# EAGLE design JustinWheelPCB1.2 (EAGLE 9.6.2)
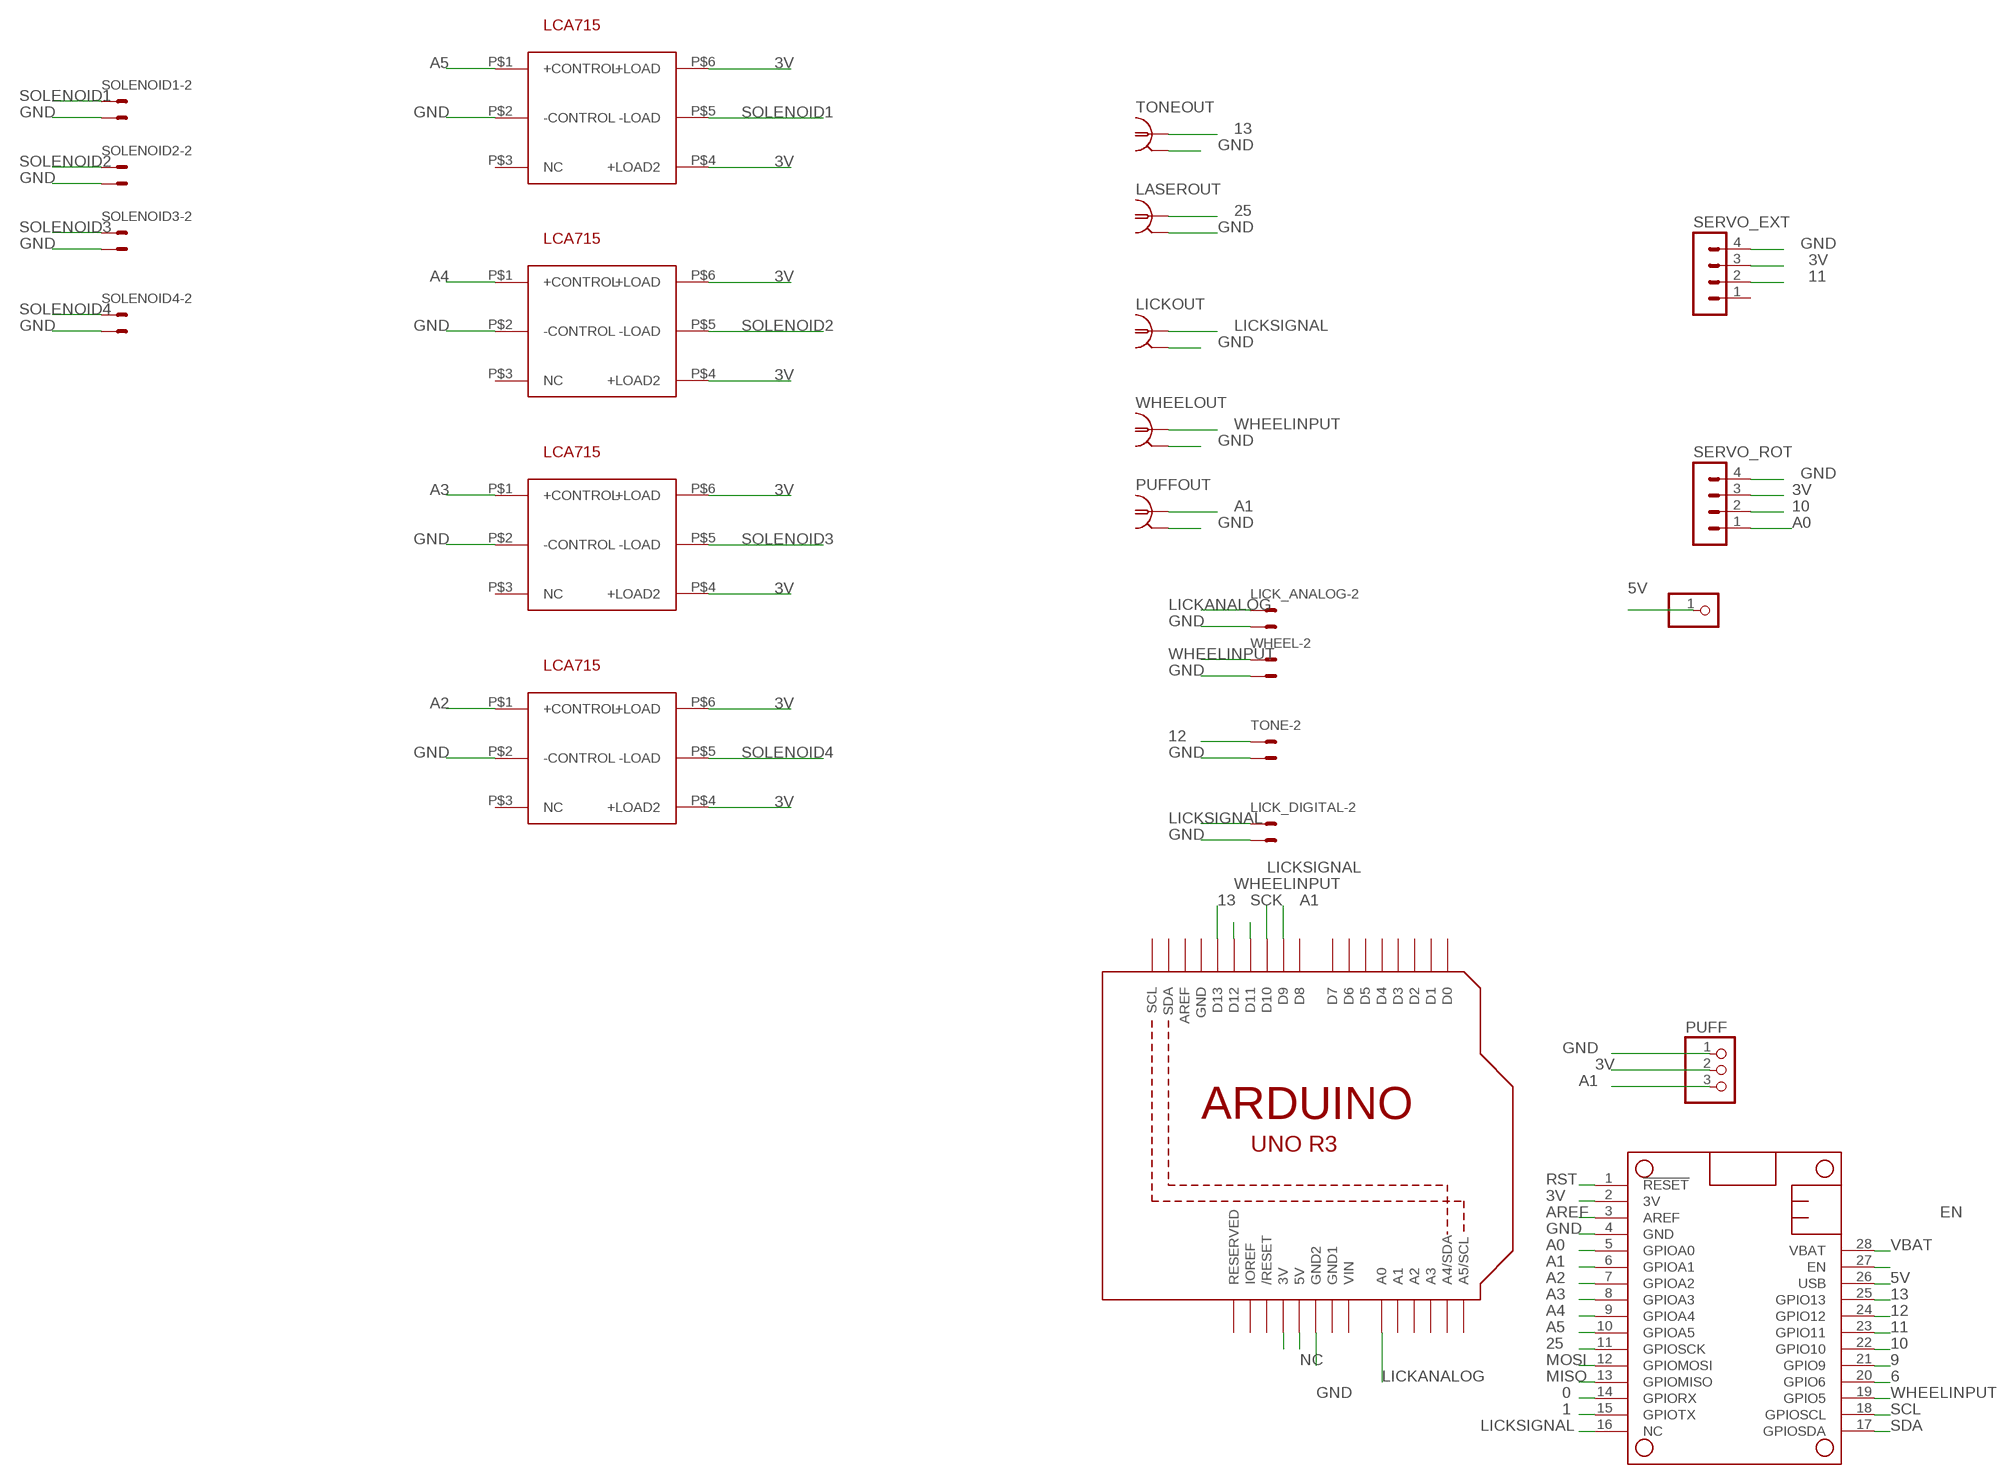
[diagram p0: schematic, sheet 1]

## Parts
JP1  PINHD-1X1  [1X01]
LASEROUT  1-227161-0  [AMP_227161]
LICK_ANALOG  22-23-2021  [22-23-2021]
LICK_DIGITAL  22-23-2021  [22-23-2021]
LICKOUT  1-227161-0  [AMP_227161]
MS2  MICROSHIELD_NODIM  [MICROSHIELD_DIM]
PUFF  PINHD-1X3  [1X03]
PUFFOUT  1-227161-0  [AMP_227161]
SERVO_EXT  MA04-1  [MA04-1]
SERVO_ROT  MA04-1  [MA04-1]
SOL1  LCA715S  [LCA7XX]
SOL2  LCA715S  [LCA7XX]
SOL3  LCA715S  [LCA7XX]
SOL4  LCA715S  [LCA7XX]
SOLENOID1  22-23-2021  [22-23-2021]
SOLENOID2  22-23-2021  [22-23-2021]
SOLENOID3  22-23-2021  [22-23-2021]
SOLENOID4  22-23-2021  [22-23-2021]
TONE  22-23-2021  [22-23-2021]
TONEOUT  1-227161-0  [AMP_227161]
U1  ARDUINOR3-BPLACE  [ARDUINOR3-BPLACE]
WHEEL  22-23-2021  [22-23-2021]
WHEELOUT  1-227161-0  [AMP_227161]

## Nets
0: MS2.14(GPIORX)
1: MS2.15(GPIOTX)
3V: MS2.2(3V) PUFF.2 SERVO_EXT.3 SERVO_ROT.3 SOL1.P$4(+LOAD2) SOL1.P$6(+LOAD) SOL2.P$4(+LOAD2) SOL2.P$6(+LOAD) SOL3.P$4(+LOAD2) SOL3.P$6(+LOAD) SOL4.P$4(+LOAD2) SOL4.P$6(+LOAD)
5V: JP1.1 MS2.26(USB)
6: MS2.20(GPIO6)
9: MS2.21(GPIO9)
10: MS2.22(GPIO10) SERVO_ROT.2
11: MS2.23(GPIO11) SERVO_EXT.2
12: MS2.24(GPIO12) TONE.1
13: MS2.25(GPIO13) TONEOUT.1 U1.D13
25: LASEROUT.1 MS2.11(GPIOSCK)
A0: MS2.5(GPIOA0) SERVO_ROT.1
A1: MS2.6(GPIOA1) PUFF.3 PUFFOUT.1 U1.D9
A2: MS2.7(GPIOA2) SOL4.P$1(+CONTROL)
A3: MS2.8(GPIOA3) SOL3.P$1(+CONTROL)
A4: MS2.9(GPIOA4) SOL2.P$1(+CONTROL)
A5: MS2.10(GPIOA5) SOL1.P$1(+CONTROL)
AREF: MS2.3(AREF)
EN: MS2.27(EN)
GND [gnd]: LASEROUT.2 LICK_ANALOG.2 LICK_DIGITAL.2 LICKOUT.2 MS2.4(GND) PUFF.1 PUFFOUT.2 SERVO_EXT.4 SERVO_ROT.4 SOL1.P$2(-CONTROL) SOL2.P$2(-CONTROL) SOL3.P$2(-CONTROL) SOL4.P$2(-CONTROL) SOLENOID1.2 SOLENOID2.2 SOLENOID3.2 SOLENOID4.2 TONE.2 TONEOUT.2 U1.GND2 WHEEL.2 WHEELOUT.2
LICKANALOG: LICK_ANALOG.1 U1.A0
LICKSIGNAL: LICK_DIGITAL.1 LICKOUT.1 MS2.16(NC) U1.D10
MISO: MS2.13(GPIOMISO)
MOSI: MS2.12(GPIOMOSI)
N$1: U1.3V
NC: U1.5V
RST: MS2.1(!RESET)
SCK: U1.D11
SCL: MS2.18(GPIOSCL)
SDA: MS2.17(GPIOSDA)
SOLENOID1: SOL1.P$5(-LOAD) SOLENOID1.1
SOLENOID2: SOL2.P$5(-LOAD) SOLENOID2.1
SOLENOID3: SOL3.P$5(-LOAD) SOLENOID3.1
SOLENOID4: SOL4.P$5(-LOAD) SOLENOID4.1
VBAT: MS2.28(VBAT)
WHEELINPUT: MS2.19(GPIO5) U1.D12 WHEEL.1 WHEELOUT.1
Unconnected: SERVO_EXT.1 SOL1.P$3(NC) SOL2.P$3(NC) SOL3.P$3(NC) SOL4.P$3(NC) U1.A1 U1.A2 U1.A3 U1.A4(A4/SDA) U1.A5(A5/SCL) U1.AREF U1.D0 U1.D1 U1.D2 U1.D3 U1.D4 U1.D5 U1.D6 U1.D7 U1.D8 U1.IOREF U1.RESERVED U1.RESET(/RESET) U1.SCL U1.SDA

## Power pins joined to a net without a drawn wire
GND: U1.GND
GND1: U1.GND1
VIN: U1.VIN

## Library data of the parts
JP1 = pinhead:PINHD-1X1: PIN HEADER
LASEROUT LICKOUT PUFFOUT TONEOUT WHEELOUT = con-coax:?227161*: JACK, RIGHT ANGLE, 50 OHM, PCB, BNC Source: amp_227161.pdf; MF: TYCO ELECTRONICS; MPN: 1-227161; OC_FARNELL: unknown; OC_NEWARK: 33B3200
LICK_ANALOG LICK_DIGITAL SOLENOID1-SOLENOID4 TONE WHEEL = con-molex:22-23-2021: .100" (2.54mm) Center Header - 2 Pin; MF: MOLEX; MPN: 22-23-2021; OC_FARNELL: 1462926; OC_NEWARK: 25C3832
MS2 = M4:MICROSHIELD
PUFF = adafruit:PINHD-1X3: PIN HEADER
SERVO_EXT SERVO_ROT = con-lstb:MA04-1: PIN HEADER; OC_FARNELL: unknown; OC_NEWARK: unknown
SOL1-SOL4 = Mohamed's-library:LCA715S
U1 = adafruit:ARDUINOR3: This is a new object for the new Arduino R3 - with extra pins that you may want to use (such as IOref, and duplicated A4/A5

## Net classes
1 power: width 0.305 mm
2 gnd: width 0.254 mm

## Board
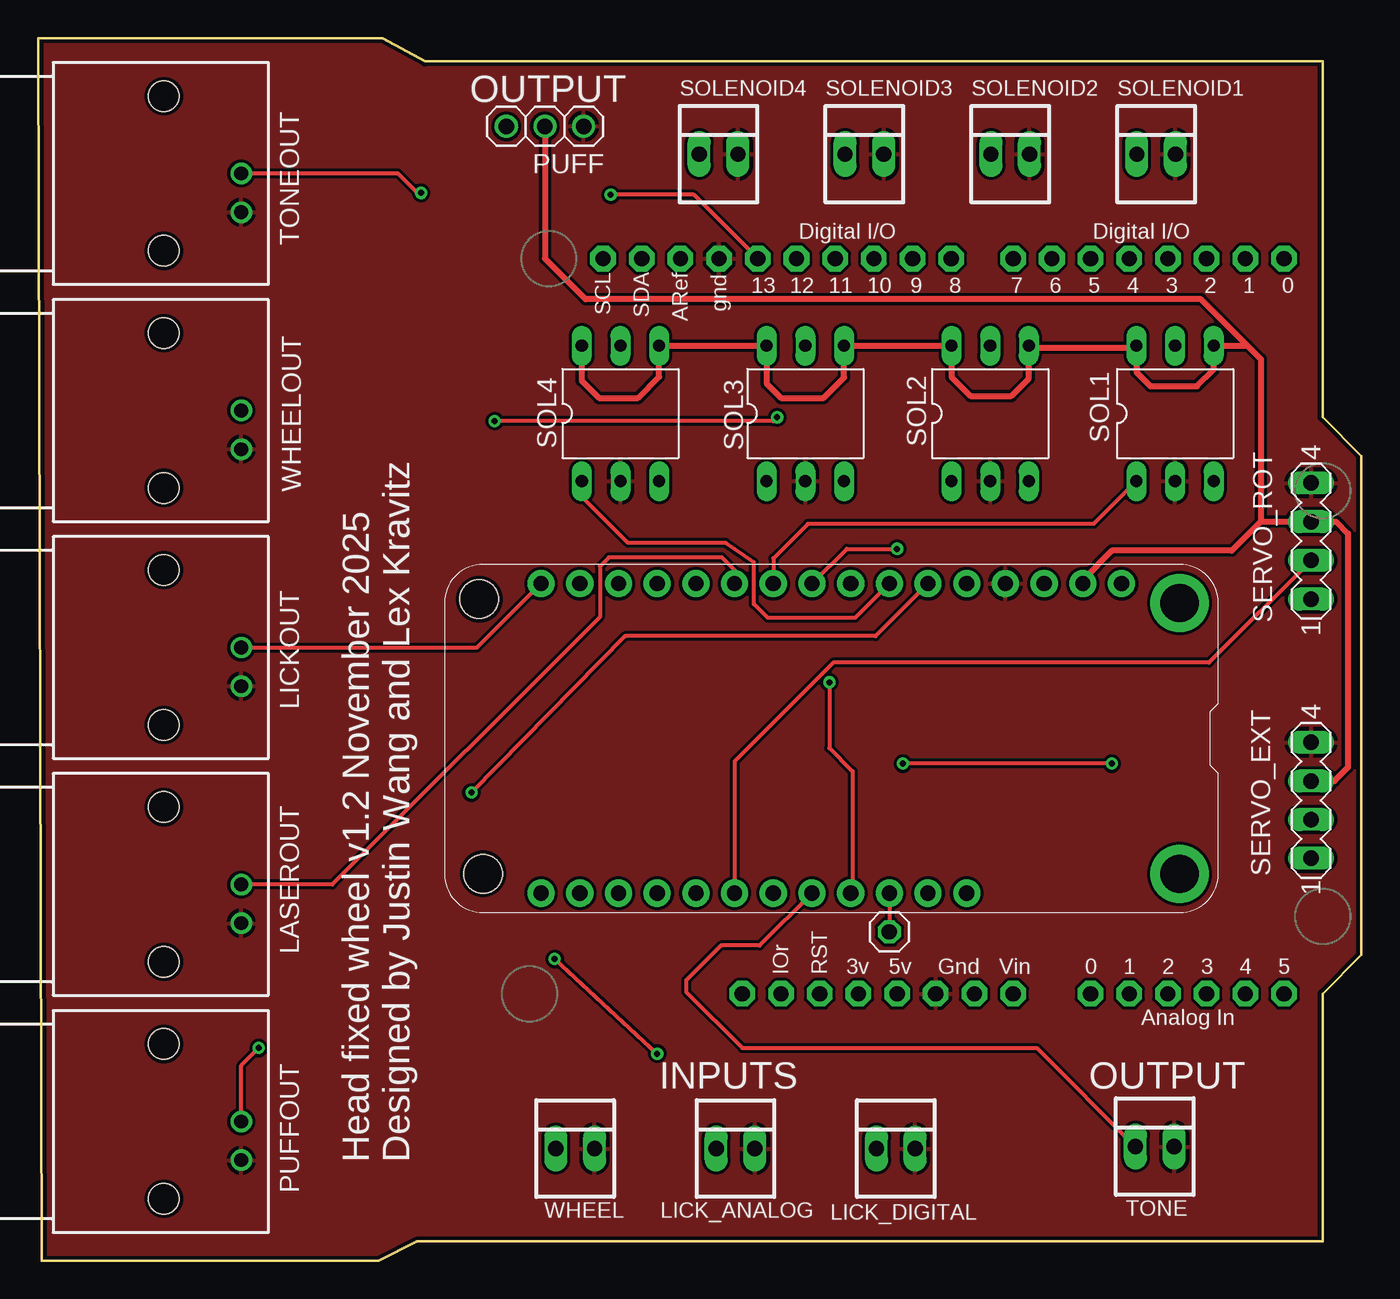
[diagram p1: board, top side]
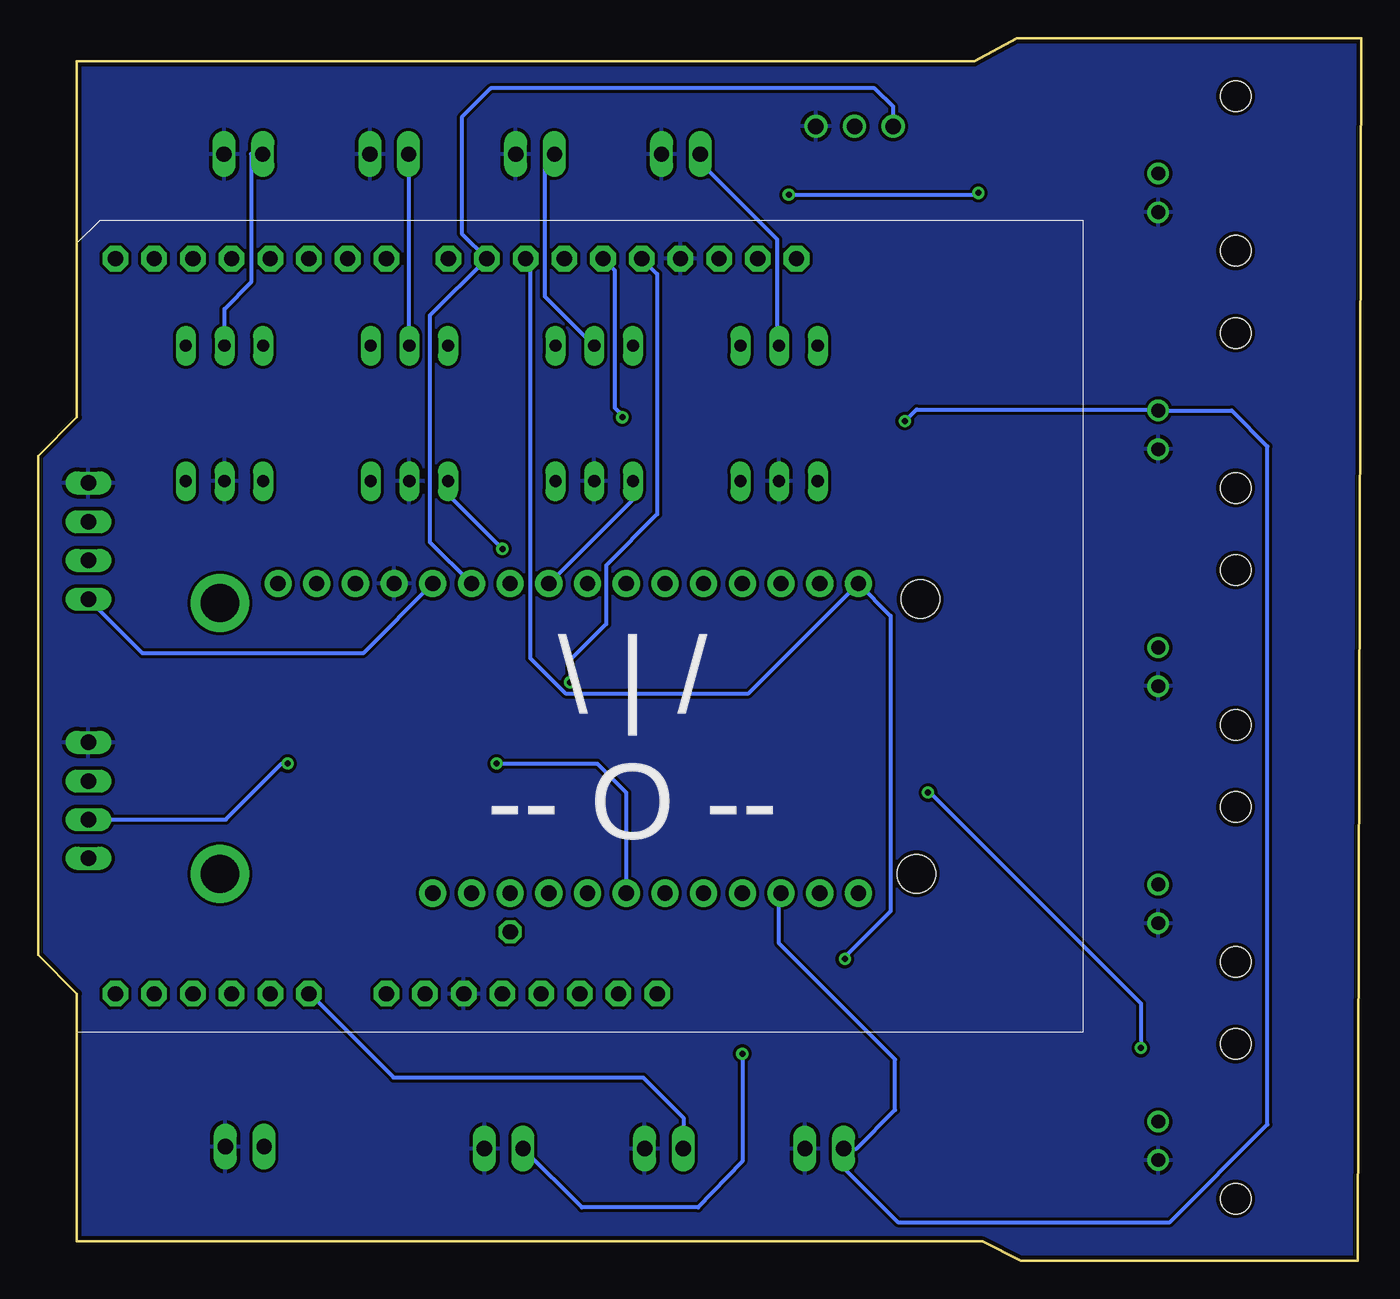
[diagram p2: board, bottom side, seen from below]

Size 86.87 x 80.26 mm. Coordinates in mm from the lower left corner, seen from the top.
Outline: 84.33,55.37 84.33,78.74 25.4,78.74 22.61,80.26 0,80.26 0.25,0 22.35,0 24.89,1.27 84.33,1.27 84.33,17.53 86.87,20.07 86.87,52.83 84.33,55.37
Copper layers (1*16): Top 0.035mm / dielectric 1.5mm / Bottom 0.035mm
Design rules "adafruit": minimum track width 8mil, minimum drill 15.5mil, track to track 8mil, track to pad 8mil, pad to pad 8mil, via to via 8mil, smd to smd 8mil, copper to edge 10mil, drill to drill 8mil, minimum pad ring 10mil, minimum via ring 8mil, stop-mask expansion 2mil, vias tented up to drill 20mil, thermal gap 10mil

### Footprints (pad centres in the part's own frame; a part is rotated, then mirrored left to right if it is on the bottom)
1X01 = drill 1.016 octagon: 1 0,0
AMP_227161 = drill 0.9 pad 1.27: 1 0,-5.08; 2 -2.54,-5.08 | hole 2: -5.08,0; 5.08,0
22-23-2021 = drill 1 long: 1 -1.27,0; 2 1.27,0
MICROSHIELD_DIM = drill 1 pad 1.778: 1 6.35,1.27; 2 8.89,1.27; 3 11.43,1.27; 4 13.97,1.27; 5 16.51,1.27; 6 19.05,1.27; 7 21.59,1.27; 8 24.13,1.27; 9 26.67,1.27; 10 29.21,1.27; 11 31.75,1.27; 12 34.29,1.27; 13 36.83,1.27; 14 39.37,1.27; 15 41.91,1.27; 16 44.45,1.27; 17 44.45,21.59; 18 41.91,21.59; 19 39.37,21.59; 20 36.83,21.59; 21 34.29,21.59; 22 31.75,21.59; 23 29.21,21.59; 24 26.67,21.59; 25 24.13,21.59; 26 21.59,21.59; 27 19.05,21.59; 28 16.51,21.59 | drill 2.5 pad 3.81: P$1 2.54,20.32; P$2 2.54,2.54 | hole 2.54: 48.26,20.32; 48.514,2.286
1X03 = drill 1.016: 1 -2.54,0; 2 0,0; 3 2.54,0
MA04-1 = drill 1.016 long: 1 -3.81,0; 2 -1.27,0; 3 1.27,0; 4 3.81,0
LCA7XX = drill 0.8 long: P$1 -5.08,2.54; P$2 -5.08,0; P$3 -5.08,-2.54; P$4 3.81,-2.54; P$5 3.81,0; P$6 3.81,2.54
ARDUINOR3-BPLACE = drill 1 pad 1.676 octagon: 3V 35.56,2.54; 5V 38.1,2.54; A0 50.8,2.54; A1 53.34,2.54; A2 55.88,2.54; A3 58.42,2.54; A4 60.96,2.54; A5 63.5,2.54; AREF 23.876,50.8; D0 63.5,50.8; D1 60.96,50.8; D2 58.42,50.8; D3 55.88,50.8; D4 53.34,50.8; D5 50.8,50.8; D6 48.26,50.8; D7 45.72,50.8; D8 41.656,50.8; D9 39.116,50.8; D10 36.576,50.8; D11 34.036,50.8; D12 31.496,50.8; D13 28.956,50.8; GND 26.416,50.8; GND1 43.18,2.54; GND2 40.64,2.54; IOREF 30.48,2.54; RESERVED 27.94,2.54; RESET 33.02,2.54; SCL 18.796,50.8; SDA 21.336,50.8; VIN 45.72,2.54

### Placement (x,y rotation side)
JP1  55.88,21.59 0 top
LASEROUT  8.25,24.7 90 top
LICK_ANALOG  45.78,7.37 0 top
LICK_DIGITAL  56.3,7.37 0 top
LICKOUT  8.25,40.26 90 top
MS2  77.47,45.72 180 top
PUFF  33.27,74.47 180 top
PUFFOUT  8.25,9.14 90 top
SERVO_EXT  83.57,30.23 90 top
SERVO_ROT  83.57,47.24 90 top
SOL1  74.63,56.26 90 top
SOL2  62.5,56.26 90 top
SOL3  50.36,56.26 90 top
SOL4  38.23,56.26 90 top
SOLENOID1  73.39,72.64 0 top
SOLENOID2  63.82,72.64 0 top
SOLENOID3  54.24,72.64 0 top
SOLENOID4  44.67,72.64 0 top
TONE  73.3,7.49 0 top
TONEOUT  8.25,71.37 90 top
U1  18.29,14.99 0 top
WHEEL  35.26,7.37 0 top
WHEELOUT  8.25,55.82 90 top

### Tracks (layer width: path | path; a pad name or v marks a point on that pad's centre or on a via)
3V
  Top 0.406: 80.26,48.51 80.26,59.18 79.38,60.07 | SOL1.P$6 72.09,59.94 | 72.09,59.94 72.09,58.33 73.02,57.4 76.07,57.4 77.17,58.5 SOL1.P$4 79.38,60.07 | SOL4.P$6 35.69,57.78 36.83,56.64 39.37,56.64 40.77,58.04 SOL4.P$4 SOL3.P$6 47.82,57.59 48.77,56.64 51.56,56.64 52.9,57.98 SOL3.P$4 SOL2.P$6 59.96,58.03 61.21,56.77 63.88,56.77 65.04,57.93 SOL2.P$4 65.16,59.94 72.09,59.94 | 80.26,48.51 78.36,46.61 70.48,46.61 68.58,44.7 MS2.2 | 80.26,48.51 SERVO_ROT.3 85.22,48.51 85.98,47.75 85.98,32.39 85.09,31.5 SERVO_EXT.3 | 79.38,60.07 76.33,63.12 35.94,63.12 33.27,65.79 PUFF.2
5V
  Top 0.254: MS2.26 JP1.1
10
  Top 0.254: SERVO_ROT.2 76.86,39.27 52.2,39.27 45.72,32.78 MS2.22
11  (via drill 0.39)
  Top 0.254: v70.48,32.64 57.02,32.64 56.9,32.51 v56.77,32.64
  Bottom 0.254: SERVO_EXT.2 74.55,28.96 70.87,32.64 v70.48,32.64 | v56.77,32.64 50.16,32.64 48.26,30.73 MS2.23 | MS2.23 48.13,24 48.13,23.5 48.26,23.62 MS2.23
12
  Top 0.254: MS2.24 47.37,20.7 44.83,20.7 42.55,18.41 42.55,17.65 46.23,13.97 65.55,13.97 TONE.1
13  (via drill 0.39)
  Top 0.254: U1.D13 43.05,69.98 v37.59,69.98 | v25.15,70.1 24.89,70.1 23.62,71.37 TONEOUT.1 | v51.94,37.97 51.94,33.66 53.47,32.13 53.47,24.26 MS2.25
  Bottom 0.254: v37.59,69.98 25.27,69.98 v25.15,70.1 | v51.94,37.97 51.94,39.42 49.58,41.79 49.58,45.66 46.23,49.01 46.23,64.77 U1.D13
25
  Top 0.254: MS2.11 45.72,45.34 44.88,46.18 37.47,46.18 36.88,45.59 36.88,42.27 19.31,24.7 LASEROUT.1
A0
  Bottom 0.254: MS2.5 65.53,39.88 80.01,39.88 SERVO_ROT.1
A1  (via drill 0.39)
  Top 0.254: PUFFOUT.1 13.33,12.83 v14.48,13.97 | MS2.6 54.97,41 38.54,41 v28.45,30.73
  Bottom 0.254: PUFF.3 30.73,75.74 31.95,76.96 57.15,76.96 59.05,75.06 59.05,67.44 U1.D9 61.16,62.03 61.16,47.19 MS2.6 | v28.45,30.73 28.32,30.73 14.48,16.89 v14.48,13.97
A2
  Top 0.254: SOL4.P$1 35.69,50.17 38.73,47.12 45.14,47.12 46.99,45.85 46.99,43.11 47.88,42.22 53.64,42.22 MS2.7
A3
  Bottom 0.254: MS2.8 47.82,49.97 SOL3.P$1
A4  (via drill 0.39)
  Top 0.254: MS2.9 53.09,46.74 v56.39,46.74
  Bottom 0.254: v56.39,46.74 59.96,50.31 SOL2.P$1
A5
  Top 0.254: SOL1.P$1 69.28,48.37 50.53,48.37 48.26,46.1 MS2.10
GND
  pour Top: -3.81,82.8 92.2,82.8 96.52,78.49 96.52,0.51 94.23,-1.78 -2.29,-1.78 -2.29,75.44 -4.32,77.47 -4.32,82.04
  pour Bottom: -5.08,84.07 93.73,84.07 98.55,79.25 98.55,-2.29 96.52,-4.32 -2.54,-4.32 -7.37,0.51 -7.37,81.53
LICKANALOG
  Bottom 0.254: U1.A0 69.02,17.53 63.53,12.03 47.15,12.03 44.51,9.4 LICK_ANALOG.1
LICKSIGNAL  (via drill 0.39)
  Top 0.254: LICKOUT.1 28.83,40.26 MS2.16 | v33.91,19.81 v40.64,13.59
  Bottom 0.254: LICK_DIGITAL.1 51.16,3.5 43.55,3.5 40.64,6.53 v40.64,13.59 | U1.D10 54.56,65.48 54.56,39.56 52.24,37.24 40.23,37.24 MS2.16 30.91,42.34 30.91,22.95 33.91,19.95 v33.91,19.81
SOLENOID1
  Bottom 0.254: SOLENOID1.1 72.88,72.64 72.88,64.23 74.63,62.48 SOL1.P$5
SOLENOID2
  Bottom 0.254: SOLENOID2.1 62.55,60.12 SOL2.P$5
SOLENOID3
  Bottom 0.254: SOLENOID3.1 53.61,72.01 53.61,63.31 SOL3.P$5
SOLENOID4
  Bottom 0.254: SOLENOID4.1 43.4,72.1 38.35,67.06 38.35,60.2 SOL4.P$5
WHEELINPUT  (via drill 0.39)
  Top 0.254: v48.51,55.37 48.26,55.12 v29.97,55.12
  Bottom 0.254: U1.D12 49.02,65.02 49.02,56.01 48.51,55.5 v48.51,55.37 | v29.97,55.12 29.21,55.88 13.4,55.88 WHEELOUT.1 8.52,55.82 6.17,53.46 6.17,8.95 12.58,2.54 30.43,2.54 33.99,6.1 WHEEL.1 33.15,7.37 30.61,9.91 30.61,13.21 38.23,20.83 38.23,24
  Bottom 0.406: 38.23,24 MS2.19

### Text on the board
tNames: OUTPUT | INPUTS | OUTPUT | Head fixed wheel v1.2 November 2025 / Designed by Justin Wang and Lex Kravitz
bNames: \\ | / / -- O --